# Altium schematic sheet dimmer.SchDoc
size A1
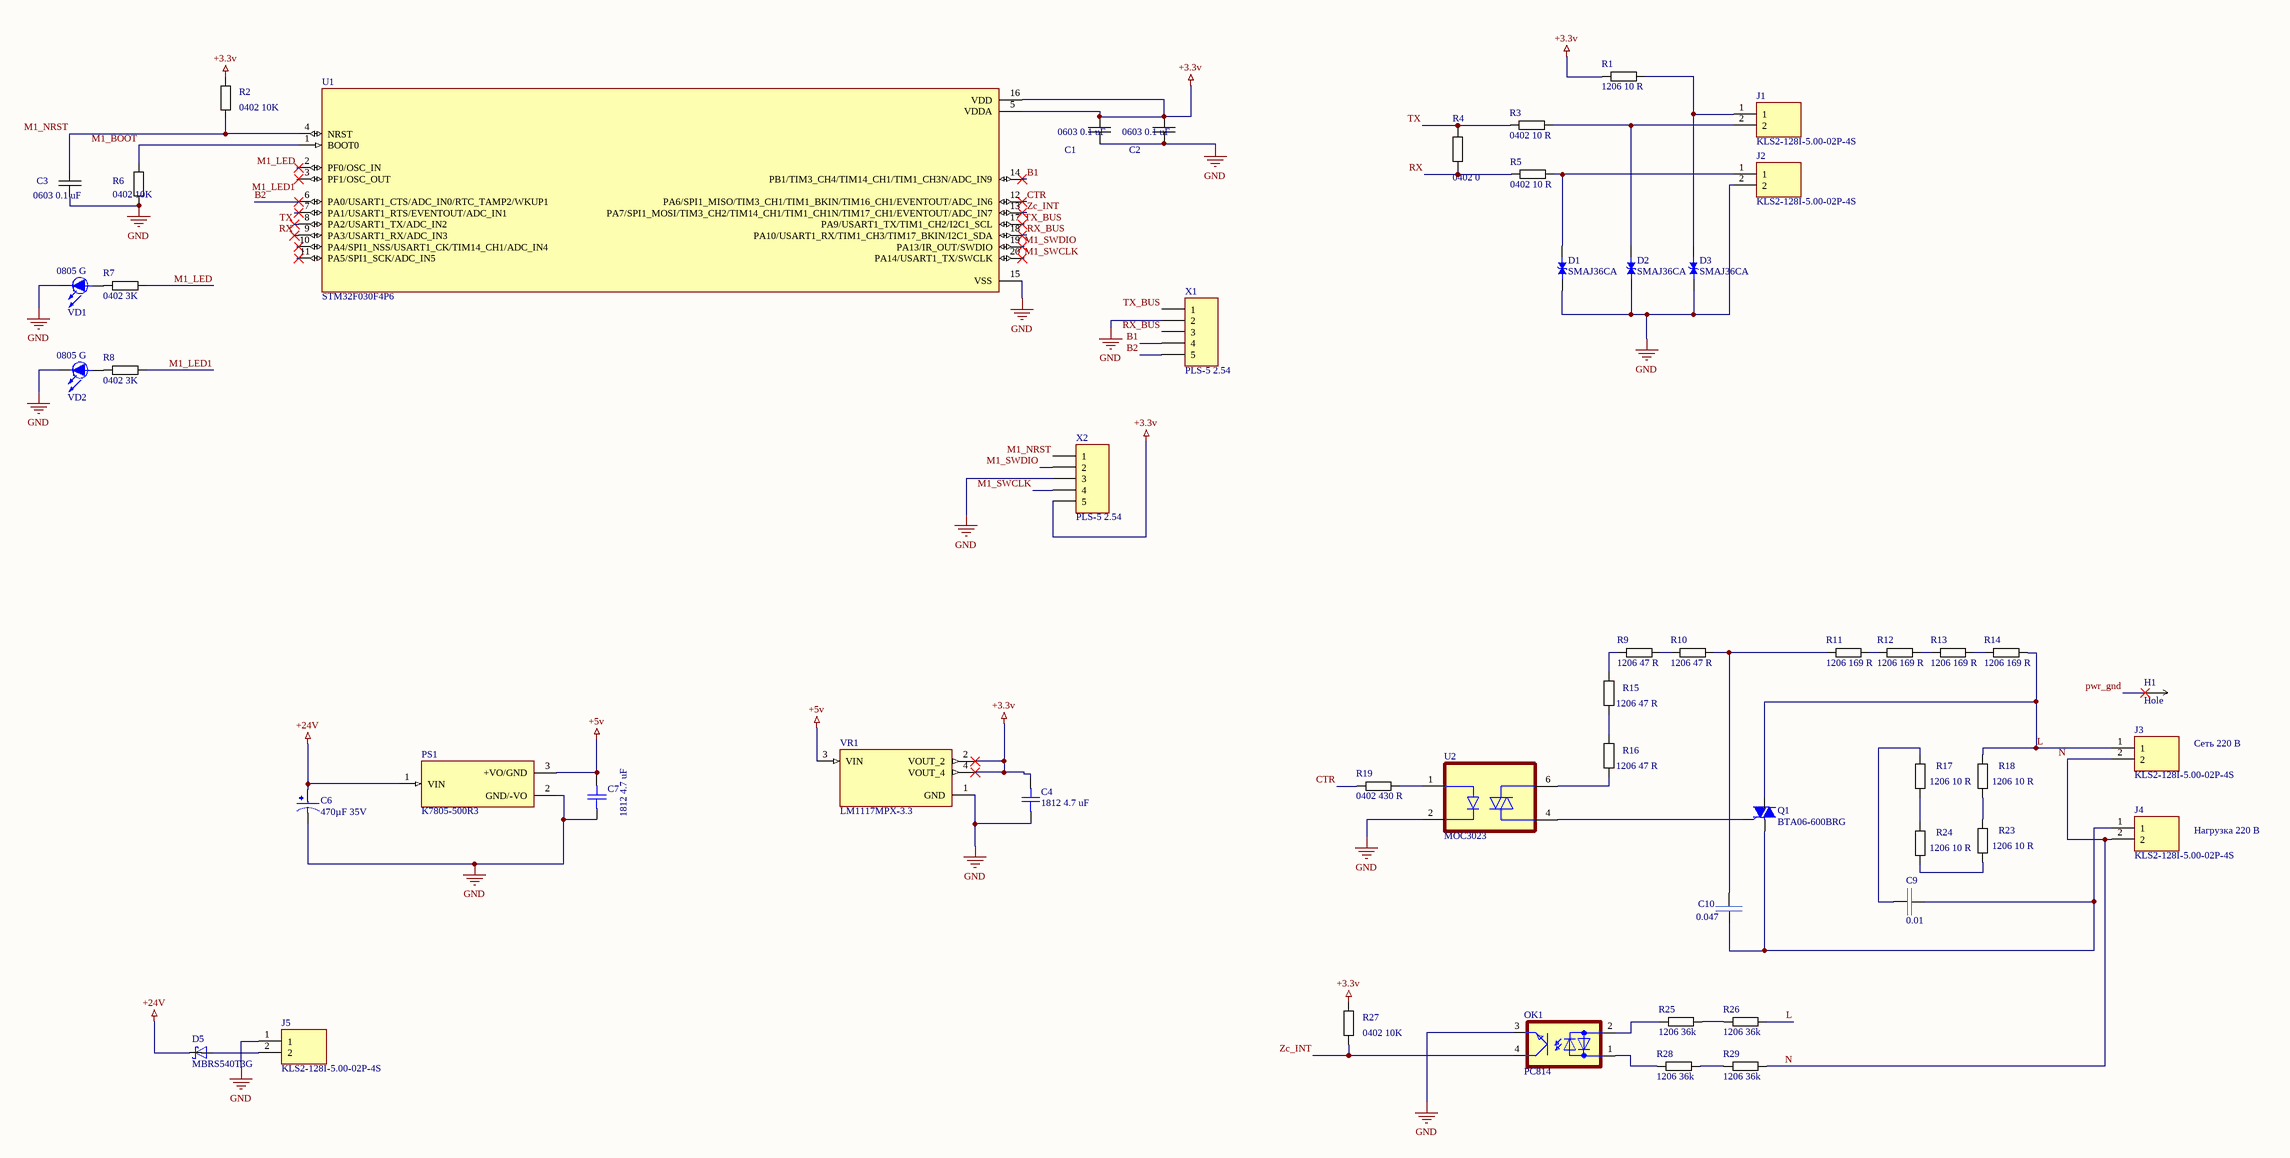
[diagram p0: dimmer.SchDoc]

## Parts
C1  0603 0.1 uF  [CAPACITOR 0603]
C2  0603 0.1 uF  [CAPACITOR 0603]
C3  0603 0.1 uF  [CAPACITOR 0603]
C4  1812 4.7 uF  [CAPCHIP1812]
C6  470µF 35V  [CAP_EEEFK1V471SV]
C7  1812 4.7 uF  [CAPCHIP1812]
C9  0.01  [CAPRR1000W60L1300T400H900]
C10  0.047  [CAPRR1000W60L1300T400H900]
D1  SMAJ36CA  [DIOM4325X250N]
D2  SMAJ36CA  [DIOM4325X250N]
D3  SMAJ36CA  [DIOM4325X250N]
D5  MBRS540T3G  [DIOM7958X213N]
H1  Hole  [Hole 1.5]
J1  KLS2-128I-5.00-02P-4S  [CUI_TB003-500-P02BE]
J2  KLS2-128I-5.00-02P-4S  [CUI_TB003-500-P02BE]
J3  KLS2-128I-5.00-02P-4S  [CUI_TB003-500-P02BE]
J4  KLS2-128I-5.00-02P-4S  [CUI_TB003-500-P02BE]
J5  KLS2-128I-5.00-02P-4S  [CUI_TB003-500-P02BE]
OK1  PC814  [DIL04]
PS1  K7805-500R3  [CONV_K7805-500R3]
Q1  BTA06-600BRG  [TO254P1040X460X1975-3]
R1  1206 10 R  [Resistor 1206]
R2  0402 10K  [Resistor 0402]
R3  0402 10 R  [Resistor 0402]
R4  0402 0  [Resistor 0402]
R5  0402 10 R  [Resistor 0402]
R6  0402 10K  [Resistor 0402]
R7  0402 3K  [Resistor 0402]
R8  0402 3K  [Resistor 0402]
R9  1206 47 R  [Resistor 1206]
R10  1206 47 R  [Resistor 1206]
R11  1206 169 R  [Resistor 1206]
R12  1206 169 R  [Resistor 1206]
R13  1206 169 R  [Resistor 1206]
R14  1206 169 R  [Resistor 1206]
R15  1206 47 R  [Resistor 1206]
R16  1206 47 R  [Resistor 1206]
R17  1206 10 R  [Resistor 1206]
R18  1206 10 R  [Resistor 1206]
R19  0402 430 R  [Resistor 0402]
R23  1206 10 R  [Resistor 1206]
R24  1206 10 R  [Resistor 1206]
R25  1206 36k  [Resistor 1206]
R26  1206 36k  [Resistor 1206]
R27  0402 10K  [Resistor 0402]
R28  1206 36k  [Resistor 1206]
R29  1206 36k  [Resistor 1206]
U1  STM32F030F4P6  [SOP65P640X120-20N]
U2  MOC3023  [DIP762W48P254L889H508Q6]
VD1  0805 G  [0805-]
VD2  0805 G  [0805-]
VR1  LM1117MPX-3.3  [VREG_LM1117MPX-3.3]
X1  PLS-5 2.54  [PLS-5-3D]
X2  PLS-5 2.54  [PLS-5-3D]

## Nets
+3.3v: C1.1 C2.1 C4.1 R1.2 R2.2 R27.2 U1.5(VDDA) U1.16(VDD) VR1.2(VOUT_2) VR1.4(VOUT_4) X2.5
+5v: C7.2 PS1.3(+VO/GND) VR1.3(VIN)
+24V: C6.1 D5.C PS1.1(VIN)
GND: C1.2 C2.2 C3.1 C4.2 C6.2 C7.1 D1.2 D2.2 D3.2 J2.2 J5.1 OK1.3(E) PS1.2(GND/-VO) R6.2 U1.15(VSS) U2.2(CATHODE) VD1.K(k) VD2.K(k) VR1.1(GND) X1.2 X2.3
B1: U1.14(PB1/TIM3_CH4/TIM14_CH1/TIM1_CH3N/ADC_IN9) X1.4
B2: U1.6(PA0/USART1_CTS/ADC_IN0/RTC_TAMP2/WKUP1) X1.5
CTR: R19.2 U1.12(PA6/SPI1_MISO/TIM3_CH1/TIM1_BKIN/TIM16_CH1/EVENTOUT/ADC_IN6)
L: J3.1 Q1.2(A2) R14.1 R18.2 R26.2
M1_BOOT: R6.1 U1.1(BOOT0)
M1_LED: R7.1 U1.2(PF0/OSC_IN)
M1_LED1: R8.1 U1.3(PF1/OSC_OUT)
M1_NRST: C3.2 R2.1 U1.4(NRST) X2.1
M1_SWCLK: U1.20(PA14/USART1_TX/SWCLK) X2.4
M1_SWDIO: U1.19(PA13/IR_OUT/SWDIO) X2.2
N: J3.2 J4.2 R29.2
pwr_gnd: H1.0
RX: R4.2 R5.2 U1.9(PA3/USART1_RX/ADC_IN3)
RX_BUS: U1.18(PA10/USART1_RX/TIM1_CH3/TIM17_BKIN/I2C1_SDA) X1.3
TX: R3.2 R4.1 U1.8(PA2/USART1_TX/ADC_IN2)
TX_BUS: U1.17(PA9/USART1_TX/TIM1_CH2/I2C1_SCL) X1.1
Zc_INT: OK1.4(C) R27.1 U1.13(PA7/SPI1_MOSI/TIM3_CH2/TIM14_CH1/TIM1_CH1N/TIM17_CH1/EVENTOUT/ADC_IN7)
NetC9_1: C9.1 C10.2 J4.1 Q1.1(A1)
NetC9_2: C9.2 R17.2
NetC10_1: C10.1 R10.1 R11.2
NetD1_1: D1.1 J2.1 R5.1
NetD2_1: D2.1 J1.2 R3.1
NetD3_1: D3.1 J1.1 R1.1
NetD5_A: D5.A J5.2
NetOK1_1: OK1.1(AC1) R28.1
NetOK1_2: OK1.2(AC2) R25.1
NetQ1_3: Q1.3(G) U2.4(MAINTERMINAL_1)
NetR7_2: R7.2 VD1.A(a)
NetR8_2: R8.2 VD2.A(a)
NetR9_1: R9.1 R10.2
NetR9_2: R9.2 R15.1
NetR11_1: R11.1 R12.2
NetR12_1: R12.1 R13.2
NetR13_1: R13.1 R14.2
NetR15_2: R15.2 R16.1
NetR16_2: R16.2 U2.6(MAINTERMINAL_2)
NetR17_1: R17.1 R24.2
NetR18_1: R18.1 R23.2
NetR19_1: R19.1 U2.1(ANODE)
NetR23_1: R23.1 R24.1
NetR25_2: R25.2 R26.1
NetR28_2: R28.2 R29.1

Not connected (* = marked no-connect by the designer): U1 7(PA1/USART1_RTS/EVENTOUT/ADC_IN1)* 10(PA4/SPI1_NSS/USART1_CK/TIM14_CH1/ADC_IN4)* 11(PA5/SPI1_SCK/ADC_IN5)*

## Notes on the sheet
- Сеть 220 В
- Нагрузка 220 В

## Library data of the parts
C1-C3 = Capasitor: Ceramic Capacitor; Value: 0603 0.1 uF; Package: 0603
C4 C7 = Cap C: Ceramic Capacitor; Class: Электронные компоненты; SubClass: Конденсаторы; TKE: {TKE}; Ordering_Information: {Ordering_Information}; Installation: {Installation}; Body: {Body}; Nominal_voltage_V: {Nominal_voltage_V}; Tolerance_Percent: {Tolerance_Percent}; Pins: {Pins}; Value: 1812 4.7 uF; Package: 1812
C6 = EEEFK1V471SV: EEEFK1V471SV 470µF 35V Aluminum Electrolytic Capacitors Radial, Can - SMD 80mOhm @ 100kHz 2000 Hrs @ 105°C; MP: EEE-FK1V471SV; MF: Panasonic Electronic Components; Package: RADIAL-2 Panasonic; Availability: In Stock; Value: 470µF 35V; SnapEDA_Link: https://www.snapeda.com/parts/EEE-FK1V471SV/Panasonic/view-part/?ref=snap; Price: None; Check_prices: https://www.snapeda.com/parts/EEE-FK1V471SV/Panasonic/view-part/?ref=eda; Purchase-URL: https://pricing.snapeda.com/search/part/EEE-FK1V471SV/?ref=eda
C9 C10 = HV_CAP
  C9: value: 0.01
  C10: value: 0.047
D5 = MBRS540T3G: Diode Schottky 40V 5A Surface Mount SMC; MF: ON Semiconductor; SnapEDA_Link: https://www.snapeda.com/parts/MBRS540T3G/ON%20Semiconductor/view-part/78777/?ref=snap; MP: MBRS540T3G; Availability: Unavailable; Price: None; Value: *; Package: DO-214 ON Semiconductor
J1-J5 = TB003-500-P02BE: 2~24 Poles, Screw Type, Horizontal, 5.0 Pitch, 26~14 _AWG_, Terminal Block Connector; MF: CUI Devices; MP: TB003-500-P02BE; Availability: Unavailable; Package: None; SnapEDA_Link: https://www.snapeda.com/parts/TB003-500-P02BE/CUI%20Devices/view-part/3590637/?ref=snap; Price: None; Value: *
OK1 = PC814: #10-32 Round Head Machine Screw Slotted Drive Nylon; MF: Essentra Components; Package: DIP-4 Sharp; Value: *; Price: None; MP: PC814; Availability: Unavailable; SnapEDA_Link: https://www.snapeda.com/parts/PC814/Essentra%20Components/view-part/624045/?ref=snap
PS1 = K7805-500R3: Linear Regulator Replacement DC DC Converter 1 Output 5V, -5V - - - 500mA, 300mA 6.5V, 7V - 36V, 31V Input; MF: MORNSUN; Availability: In Stock; Check_prices: https://www.snapeda.com/parts/K7805-500R3/MORNSUN/view-part/?ref=eda; Package: SIP-3-3 MORNSUN; Price: None; SnapEDA_Link: https://www.snapeda.com/parts/K7805-500R3/MORNSUN/view-part/?ref=snap; Value: *; Purchase-URL: https://pricing.snapeda.com/search/part/K7805-500R3/?ref=eda; MP: K7805-500R3
Q1 = BTA06-600BRG: TRIAC Standard 600V 6A Through Hole TO-220AB; MF: STMicroelectronics; MP: BTA06-600BRG; SnapEDA_Link: https://www.snapeda.com/parts/BTA06-600BRG/STMicroelectronics/view-part/107180/?ref=snap; Availability: Unavailable; Package: TO-220 STMicroelectronics; Value: *; Price: None
R1-R19 R23-R29 = Resistor
  R1 R17 R18 R23 R24: Value: 1206 10 R; Package: 1206
  R2 R6 R27: Value: 0402 10K; Package: 0402
  R3 R5: Value: 0402 10 R; Package: 0402
  R4: Value: 0402 0; Package: 0402
  R7 R8: Value: 0402 3K; Package: 0402
  R9 R10 R15 R16: Value: 1206 47 R; Package: 1206
  R11-R14: Value: 1206 169 R; Package: 1206
  R19: Value: 0402 430 R; Package: 0402
  R25 R26 R28 R29: Value: 1206 36k; Package: 1206
U1 = STM32F030F4P6: MCU 32-bit STM32F ARM Cortex M0 RISC 16KB Flash 2.5V/3.3V 20-Pin TSSOP Tray; Value: STM32F030F4P6; Availability: Unavailable; Price: None; MP: STM32F030F4P6; Package: None
U2 = MOC3023: Optoisolator Triac Output 5300Vrms 1 Channel 6-DIP; MF: ON Semiconductor; Price: None; Availability: In Stock; MP: MOC3023; Package: DIP-6 Texas Instruments; SnapEDA_Link: https://www.snapeda.com/parts/MOC3023/Onsemi/view-part/?ref=snap; Check_prices: https://www.snapeda.com/parts/MOC3023/Onsemi/view-part/?ref=eda; Value: *; Purchase-URL: https://pricing.snapeda.com/search/part/MOC3023/?ref=eda
VD1 VD2 = LED SMD: Green; CompType: LED; Note: Read; Value: 0805 G; Pins: 2; Package: 0805
VR1 = LM1117MPX-3.3: 800-mA 3.3-V linear voltage regulator; MF: Texas Instruments; Check_prices: https://www.snapeda.com/parts/LM1117MPX-3.3/Texas+Instruments/view-part/?ref=eda; Value: LM1117MPX-3.3; Availability: In Stock; MP: LM1117MPX-3.3; Price: None; Package: SOT-223-4 Texas Instruments; SnapEDA_Link: https://www.snapeda.com/parts/LM1117MPX-3.3/Texas+Instruments/view-part/?ref=snap; Purchase-URL: https://pricing.snapeda.com/search/part/LM1117MPX-3.3/?ref=eda
X1 X2 = PLS-5: Header, 5-Pin; CompType: connector; Note: header pins 2.54mm x 5; Value: PLS-5 2.54; Package: 2.54 x 5; PartNumber: PLS-5; Pins: 5
D1-D3 = SMAJ36CA: Value: SMAJ36CA; Price: None; Package: None; Availability: Unavailable; MP: SMAJ36CA